# Altium schematic sheet mic.SchDoc
size A; SheetNumber: 3; SheetTotal: 4
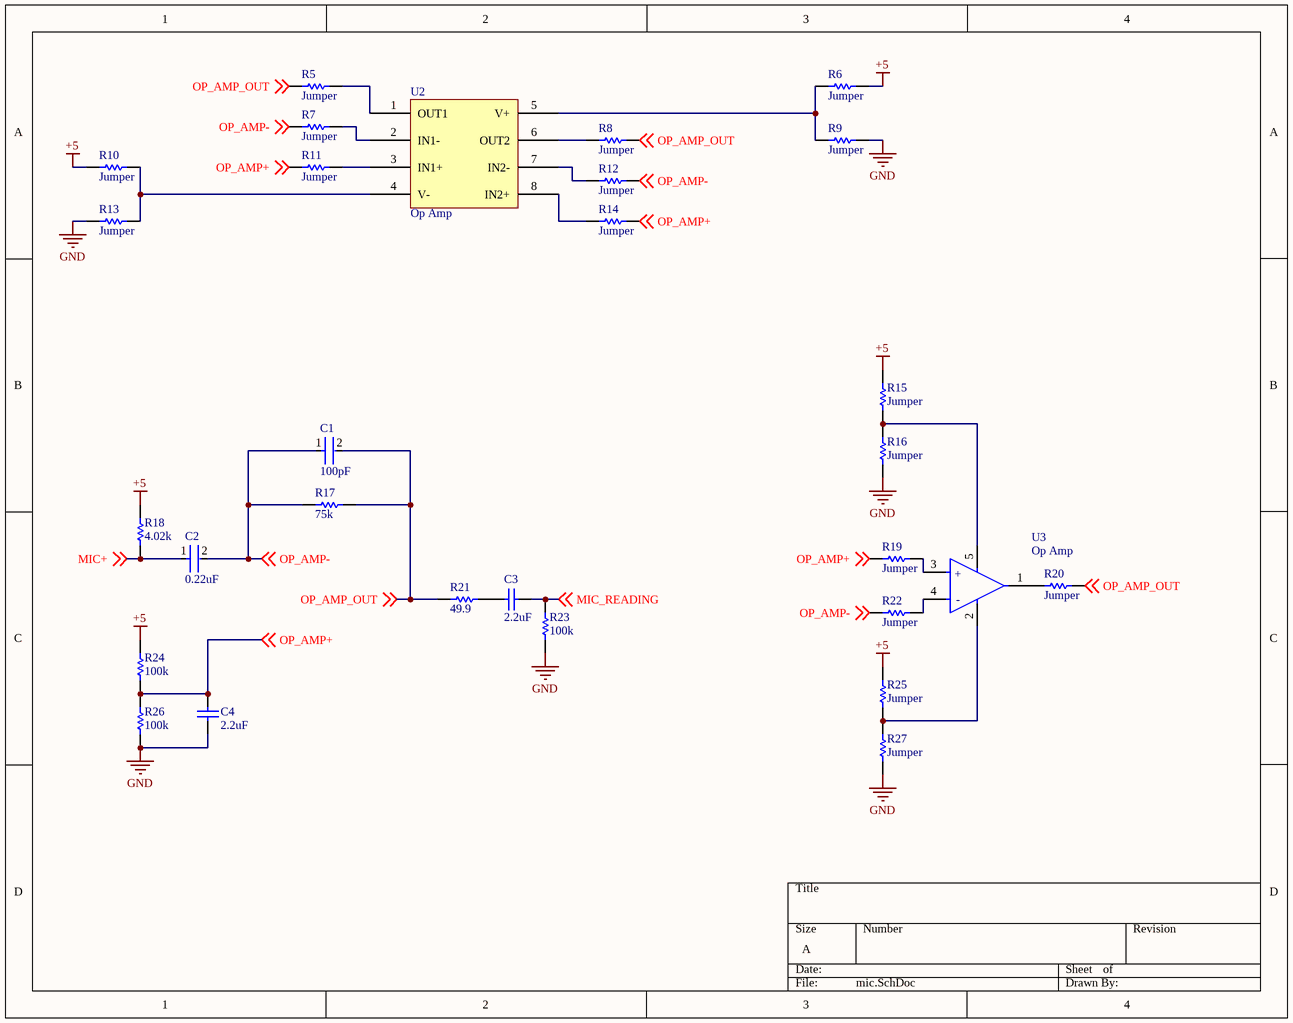
[diagram p0: mic.SchDoc]

## Parts
C1  100pF  [FP-C0805C-DN-MFG]
C2  0.22uF  [FP-C0805C-DN-MFG]
C3  2.2uF  [CAPC2113X140X50LL30T25]
C4  2.2uF  [CAPC2113X140X50LL30T25]
R5  Jumper  [RESC2013X70X40NL20T20]
R6  Jumper  [RESC2013X70X40NL20T20]
R7  Jumper  [RESC2013X70X40NL20T20]
R8  Jumper  [RESC2013X70X40NL20T20]
R9  Jumper  [RESC2013X70X40NL20T20]
R10  Jumper  [RESC2013X70X40NL20T20]
R11  Jumper  [RESC2013X70X40NL20T20]
R12  Jumper  [RESC2013X70X40NL20T20]
R13  Jumper  [RESC2013X70X40NL20T20]
R14  Jumper  [RESC2013X70X40NL20T20]
R15  Jumper  [RESC2013X70X40NL20T20]
R16  Jumper  [RESC2013X70X40NL20T20]
R17  75k  [RESC2013X70X40NL20T20]
R18  4.02k  [RESC2013X70X40NL20T20]
R19  Jumper  [RESC2013X70X40NL20T20]
R20  Jumper  [RESC2013X70X40NL20T20]
R21  49.9  [RESC2013X70X40NL20T20]
R22  Jumper  [RESC2013X70X40NL20T20]
R23  100k  [RESC2013X70X40ML20T20]
R24  100k  [RESC2013X70X40ML20T20]
R25  Jumper  [RESC2013X70X40NL20T20]
R26  100k  [RESC2013X70X40ML20T20]
R27  Jumper  [RESC2013X70X40NL20T20]
U2  Op Amp  [Op Amp]
U3  Op Amp  [FP-DBV0005A-MFG]

## Nets
+5: R6.2 R10.1 R15.1 R18.2 R24.2 R25.1
GND: C4.1 R9.2 R13.1 R16.2 R23.1 R26.1 R27.2
MIC+: C2.1 R18.1 ; off-sheet MIC+
MIC_READING: C3.1 R23.2 ; off-sheet MIC_READING
OP_AMP+: C4.2 R11.1 R14.2 R19.1 R24.1 R26.2 ; off-sheet OP_AMP+
OP_AMP-: C1.1 C2.2 R7.1 R12.2 R17.2 R22.1 ; off-sheet OP_AMP-
OP_AMP_OUT: C1.2 R5.1 R8.2 R17.1 R20.2 R21.2 ; off-sheet OP_AMP_OUT
NetC3_2: C3.2 R21.1
NetR5_2: R5.2 U2.1(OUT1)
NetR6_1: R6.1 R9.1 U2.5(V+)
NetR7_2: R7.2 U2.2(IN1-)
NetR8_1: R8.1 U2.6(OUT2)
NetR10_2: R10.2 R13.2 U2.4(V-)
NetR11_2: R11.2 U2.3(IN1+)
NetR12_1: R12.1 U2.7(IN2-)
NetR14_1: R14.1 U2.8(IN2+)
NetR15_2: R15.2 R16.1 U3.5(V+)
NetR19_2: R19.2 U3.3(+IN)
NetR20_1: R20.1 U3.1(OUT)
NetR22_2: R22.2 U3.4(-IN)
NetR25_2: R25.2 R27.1 U3.2(V-)

## Notes on the sheet
- (in symbol CMP-04893-000008-1) +; -

## Library data of the parts
C1 = CMP-03020-013647-1: CAP CER 100PF 50V C0G/NP0 0805; Manufacturer Part Number: C0805C101J5GACTU; Manufacturer: KEMET; Temperature Characteristic: C0G; Description: C0805 100 pF C0G 30ppm/°C 5.00% 50 V; Tolerance: 0.05; Material: Ceramic; Temperature Coefficient: 30ppm/°C; Temperature Range High: +125°C; Voltage Rating: 50 V; Device Class L1: Passive Components; Category: Cap; Capacitance: 100 pF; Temperature Range Low: -55°C; Height: 0.88mm; Package: C0805C-DN; Device Class L2: Capacitors; Octopart: https://octopart.com/c0805c101j5gactu-kemet-100795; Ipc Land Pattern Name: CAPC200125X78; Value: 100 pF; RoHS: TRUE; Temperature: -55°C to +125°C; Lead Free: Yes; Automotive: No; ComponentLink2URL: https://content.kemet.com/datasheets/KEM_C1003_C0G_SMD.pdf; ComponentLink2Description: Datasheet; Digikey Description: CAP CER 100PF 50V C0G/NP0 0805; Device Class L3: Ceramic Capacitors; MPN: C0805C101J5GACTU
C2 = CMP-1036-04552-2: CAP CER 0.22UF 50V X7R 0805; Manufacturer: KEMET; Manufacturer Part Number: C0805C224K5RACTU; Value: 0.22 μF; Description: C0805 0.22 μF X7R 30ppm/°C 10.00% 50 V; Temperature Coefficient: 30ppm/°C; Material: Ceramic; Tolerance: 0.1; ComponentLink2URL: https://content.kemet.com/datasheets/KEM_C1003_C0G_SMD.pdf; Temperature Characteristic: X7R; Device Class L3: Ceramic Capacitors; Lead Free: Yes; Temperature: -55°C to +125°C; RoHS: TRUE; Capacitance: 0.22 μF; Automotive: No; Octopart: https://octopart.com/c0805c224k5ractu-kemet-144670; Temperature Range Low: -55°C; Height: 0.88mm; Device Class L1: Passive Components; Digikey Description: CAP CER 0.22UF 50V X7R 0805; ComponentLink2Description: Datasheet; Mouser Description: CAP CER 0.22UF 50V X7R 0805; Category: Cap; Ipc Land Pattern Name: CAPC200125X78; Temperature Range High: +125°C; Package: C0805C-DN; Device Class L2: Capacitors; Voltage Rating: 50 V; MPN: C0805C224K5RACTU
C3 C4 = CMP-2007-00007-1: Part Number: C0805C225K8RACTU; Manufacturer: Kemet; MPN: C0805C225K8RACTU
R5-R16 R19 R20 R22 R25 R27 = CMP-1665-00002-5: Chip Resistor, 0 Ohm, +/- 1%, 0.125 W, -55 to 155 degC, 0805 (2012 Metric), RoHS, Tape and Reel; PartNumber: ERJ-6GEY0R00V; Tolerance: 5%; Resistance: 0 Ohm; REACH SVHC: No SVHC; Min Operating Temperature: -55 degC; Case/Package: 0805; Packaging: Tape and Reel; Package Quantity: 5000; ComponentLink1Description: Manufacturer URL; PackageDescription: 2-Pin Surface Mount Device, Body 2 x 1.25 mm; Mounting Technology: Surface Mount; Max Operating Temperature: 155 degC; Width: 1.25 mm; RoHSCompliant: True; Height: 0.6 mm; ComponentLink1URL: http://www.panasonic.com/; ComponentLink2URL: http://industrial.panasonic.com/cdbs/www-data/pdf/RDA0000/AOA0000C84.pdf; Case Code (Imperial): 0805; DatasheetVersion: 03/2015; Length: 2 mm; Case Code (Metric): 2012; ComponentLink2Description: Datasheet; Radiation Hardening: No; MPN: ERJ-6GEY0R00V
R17 = CMP-2001-00290-1: Part Number: ERJ-6ENF7502V; Manufacturer: Panasonic; MPN: ERJ-6ENF7502V
R18 = CMP-2001-00168-1: Part Number: ERJ-6ENF4021V; Manufacturer: Panasonic; MPN: ERJ-6ENF4021V
R21 = CMP-2001-00215-1: Part Number: ERJ-6ENF49R9V; Manufacturer: Panasonic; MPN: ERJ-6ENF49R9V
R23 R24 R26 = CMP-2001-04377-1: Part Number: ERJ-6ENF1003V; Manufacturer: Panasonic; MPN: ERJ-6ENF1003V
U3 = CMP-04893-000008-1: IC OPAMP GP 1 CIRCUIT SOT23-5; MPN: OPA172IDBVT; Gain Bandwidth Product: 10MHz; Max Supply Voltage: 36V; Number of Circuits: 1; Max Dual Supply Voltage: 18V; Operating Supply Current: 1.6mA; Output Current per Channel: 75mA; Min Dual Supply Voltage: 2.25V; Common Mode Rejection Ratio: 90dB; Voltage Gain: 130dB; Input Bias Current: 8pA; Slew Rate: 10V/µs; Min Supply Voltage: 4.5V; Input Offset Voltage (Vos): 200uV; Packaging: Cut Tape; Max Operating Temperature: 125°C; Number of Channels: 1; RoHS Compliant: Yes; REACH SVHC: No SVHC; Number of Amplifiers: 1; Lead Free: Lead Free; Number of Pins: 5; Mount: Surface Mount; Case/Package: SOT-23-5; Min Operating Temperature: -40°C; Bandwidth: 10MHz